# Altium project foxbms2-master.PrjPcb (part 6 of 7)

## Sheet io-matrix.SchDoc
size A3; DocumentNumber: 21; SheetNumber: 21; SheetTotal: 45; SheetDescription: IO Connection Matrix
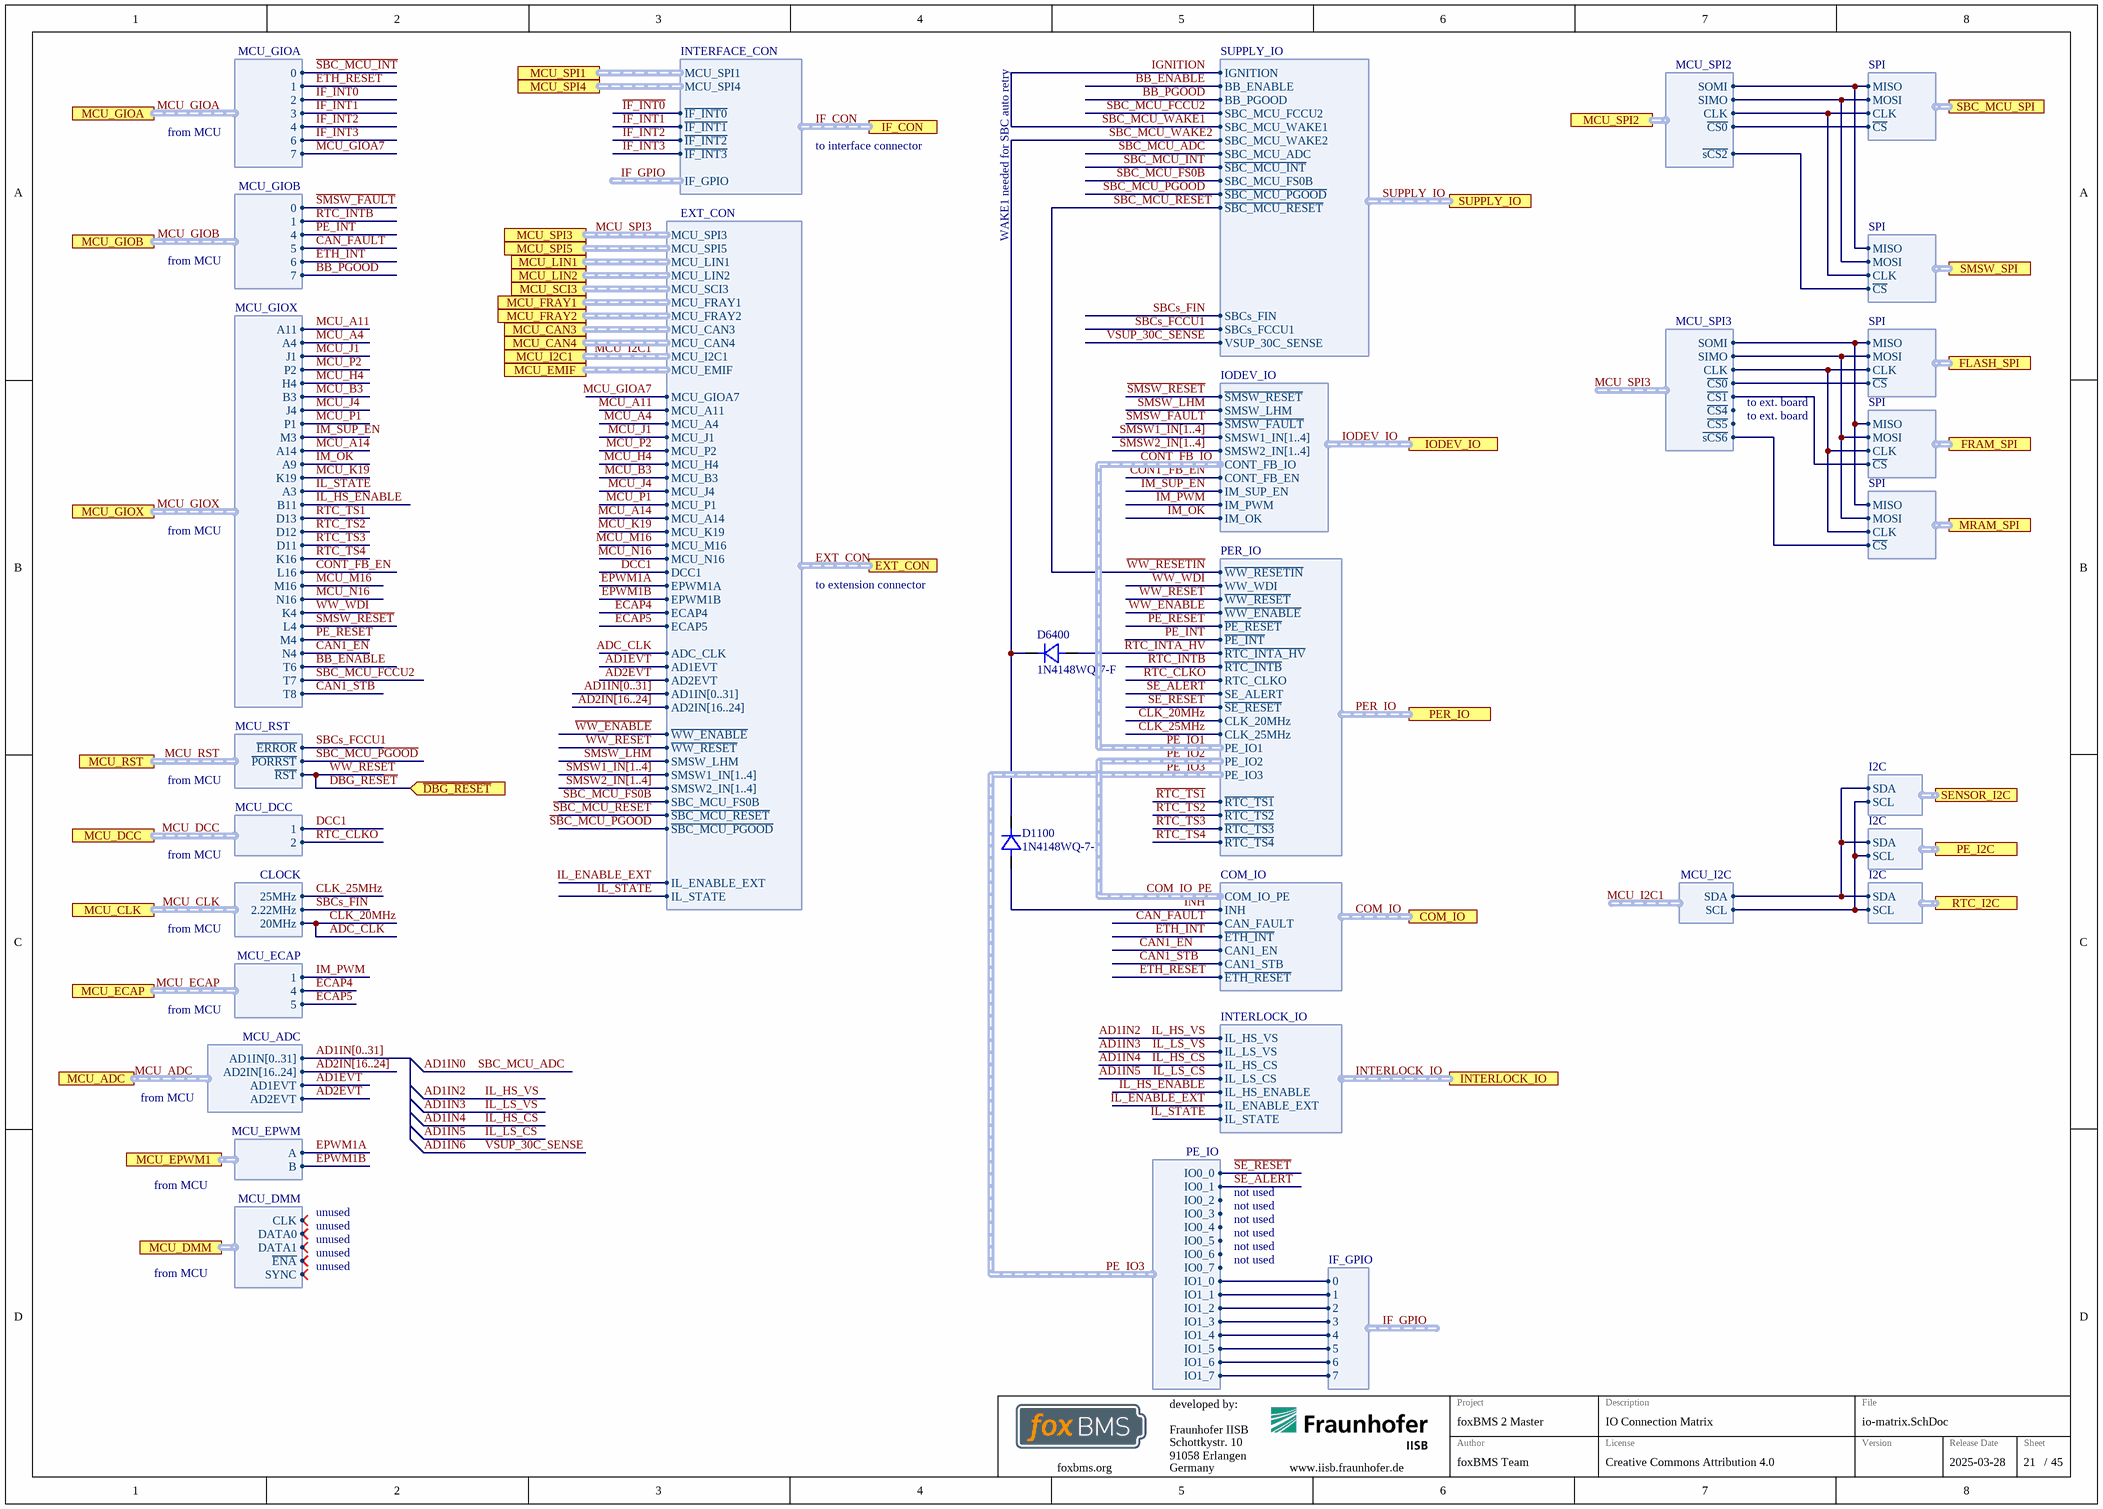
[diagram p20: io-matrix.SchDoc]

### Parts
D1100  1N4148WQ-7-F  [SOD-123_CASE-425-04-ISSUE-G]
D6400  1N4148WQ-7-F  [SOD-123_CASE-425-04-ISSUE-G]

### Ports
COM_IO (harness COM_IO), EXT_CON (harness EXT_CON), FLASH_SPI (harness SPI), FRAM_SPI (harness SPI), IF_CON (harness INTERFACE_CON), INTERLOCK_IO (harness INTERLOCK_IO), IODEV_IO (harness IODEV_IO), MCU_ADC (harness MCU_ADC), MCU_CAN3 (harness MCU_CAN), MCU_CAN4 (harness MCU_CAN), MCU_CLK (harness CLOCK), MCU_DCC (harness MCU_DCC), MCU_DMM (harness MCU_DMM), MCU_ECAP (harness MCU_ECAP), MCU_EMIF (harness MCU_EMIF), MCU_EPWM1 (harness MCU_EPWM), MCU_FRAY1 (harness MCU_FRAY), MCU_FRAY2 (harness MCU_FRAY), MCU_GIOA (harness MCU_GIOA), MCU_GIOB (harness MCU_GIOB), MCU_GIOX (harness MCU_GIOX), MCU_I2C1 (harness MCU_I2C), MCU_LIN1 (harness MCU_LIN), MCU_LIN2 (harness MCU_LIN), MCU_RST (harness MCU_RST), MCU_SCI3 (harness MCU_SCI), MCU_SPI1 (harness MCU_SPI1), MCU_SPI2 (harness MCU_SPI2), MCU_SPI3 (harness MCU_SPI3), MCU_SPI4 (harness MCU_SPI4), MCU_SPI5 (harness MCU_SPI5), MRAM_SPI (harness SPI), PE_I2C (harness I2C), PER_IO (harness PER_IO), RTC_I2C (harness I2C), SBC_MCU_SPI (harness SPI), SENSOR_I2C (harness I2C), SMSW_SPI (harness SPI), SUPPLY_IO (harness SUPPLY_IO), ~{DBG_RESET} (in)

### Harnesses
MCU_GIOX: A11, A4, J1, P2, H4, B3, J4, P1, M3, A14, A9, K19, A3, B11, D13, D12, D11, K16, L16, M16, N16, K4, L4, M4, T6, T7, N4, T8
MCU_SPI2: CLK, SIMO, SOMI, ~{CS0}, ~{sCS2}
MCU_SPI3: CLK, SIMO, SOMI, ~{CS1}, ~{CS4}, ~{CS5}, ~{CS0}, ~{sCS6}
SPI: CLK, MOSI, MISO, ~{CS}
MCU_I2C: SDA, SCL
I2C: SDA, SCL
MCU_GIOA: 0, 2, 3, 4, 6, 7, 1
MCU_RST: ~{ERROR}, ~{PORRST}, ~{RST}
MCU_DCC: 1, 2
MCU_GIOB: 0, 1, 4, 5, 6, 7
CLOCK: 2.22MHz, 20MHz, 25MHz
PE_IO: IO0_0, IO0_1, IO0_2, IO0_3, IO0_4, IO0_5, IO0_6, IO0_7, IO1_0, IO1_1, IO1_2, IO1_3, IO1_4, IO1_5, IO1_6, IO1_7
MCU_ECAP: 1, 4, 5
IODEV_IO: ~{SMSW_RESET}, SMSW_LHM, ~{SMSW_FAULT}, CONT_FB_IO, CONT_FB_EN, IM_SUP_EN, IM_PWM, IM_OK, SMSW1_IN[1..4], SMSW2_IN[1..4]
MCU_ADC: AD2IN[16..24], AD1EVT, AD2EVT, AD1IN[0..31]
SUPPLY_IO: IGNITION, BB_ENABLE, BB_PGOOD, SBC_MCU_FCCU2, SBC_MCU_WAKE1, SBC_MCU_WAKE2, SBC_MCU_ADC, ~{SBC_MCU_INT}, SBC_MCU_FS0B, ~{SBC_MCU_PGOOD}, ~{SBC_MCU_RESET}, SBCs_FIN, SBCs_FCCU1, VSUP_30C_SENSE
COM_IO: COM_IO_PE, CAN_FAULT, ~{ETH_INT}, INH, CAN1_EN, CAN1_STB, ~{ETH_RESET}
PER_IO: WW_WDI, ~{WW_RESET}, ~{WW_ENABLE}, ~{PE_RESET}, ~{PE_INT}, ~{RTC_INTA_HV}, ~{RTC_INTB}, RTC_CLKO, SE_ALERT, ~{SE_RESET}, CLK_20MHz, CLK_25MHz, PE_IO1, PE_IO2, PE_IO3, ~{RTC_TS1}, ~{RTC_TS2}, ~{RTC_TS3}, ~{RTC_TS4}, ~{WW_RESETIN}
INTERLOCK_IO: IL_HS_CS, IL_LS_CS, IL_HS_VS, IL_LS_VS, IL_HS_ENABLE, IL_STATE, IL_ENABLE_EXT
EXT_CON: MCU_SPI3, MCU_SPI5, MCU_LIN1, MCU_LIN2, MCU_FRAY1, MCU_FRAY2, MCU_CAN3, MCU_CAN4, MCU_I2C1, MCU_EMIF, DCC1, EPWM1A, EPWM1B, ECAP4, ECAP5, ADC_CLK, AD1EVT, AD2EVT, AD1IN[0..31], AD2IN[16..24], ~{WW_ENABLE}, ~{WW_RESET}, SMSW_LHM, SMSW1_IN[1..4], SMSW2_IN[1..4], SBC_MCU_FS0B, ~{SBC_MCU_RESET}, ~{SBC_MCU_PGOOD}, IL_ENABLE_EXT, IL_STATE, MCU_GIOA7, MCU_A11, MCU_A4, MCU_J1, MCU_P2, MCU_H4, MCU_B3, MCU_J4, MCU_P1, MCU_A14, MCU_K19, MCU_M16, MCU_N16, MCU_SCI3
IF_GPIO: 0, 1, 2, 3, 4, 5, 6, 7
MCU_EPWM: A, B
MCU_DMM: CLK, DATA0, DATA1, SYNC, ~{ENA}
INTERFACE_CON: MCU_SPI1, MCU_SPI4, ~{IF_INT0}, ~{IF_INT1}, ~{IF_INT2}, ~{IF_INT3}, IF_GPIO

### Nets
~{CAN1_STB}: port MCU_GIOX.T8, port COM_IO.CAN1_STB  [project net CAN1-CTRL~{.}STB]
~{DBG_RESET}: port ~{DBG_RESET}, port MCU_RST.~{RST}, port PER_IO.~{WW_RESET}, port EXT_CON.~{WW_RESET}  [also labelled ~{WW_RESET}]
~{ETH_INT}: port MCU_GIOB.6, port COM_IO.~{ETH_INT}  [project net COM_IO~{.}ETH_INT]
~{ETH_RESET}: port MCU_GIOA.1, port COM_IO.~{ETH_RESET}  [project net COM_IO~{.}ETH_RESET]
~{IF_INT0}: port MCU_GIOA.2, port IF_CON.~{IF_INT0}  [project net IF_CON~{.}IF_INT0]
~{IF_INT1}: port MCU_GIOA.3, port IF_CON.~{IF_INT1}  [project net IF_CON~{.}IF_INT1]
~{IF_INT2}: port MCU_GIOA.4, port IF_CON.~{IF_INT2}  [project net IF_CON~{.}IF_INT2]
~{IF_INT3}: port MCU_GIOA.6, port IF_CON.~{IF_INT3}  [project net IF_CON~{.}IF_INT3]
~{PE_INT}: port MCU_GIOB.4, port PER_IO.~{PE_INT}  [project net MCU_GIOB.4]
~{PE_RESET}: port MCU_GIOX.M4, port PER_IO.~{PE_RESET}  [project net MCU_GIOX.M4]
~{RTC_INTA_HV}: D6400.2(A) ; port PER_IO.~{RTC_INTA_HV}  [project net PER_IO~{.}RTC_INTA_HV]
~{RTC_INTB}: port MCU_GIOB.1, port PER_IO.~{RTC_INTB}  [project net MCU_GIOB.1]
~{RTC_TS1}: port MCU_GIOX.D13, port PER_IO.~{RTC_TS1}  [project net MCU_GIOX.D13]
~{RTC_TS2}: port MCU_GIOX.D12, port PER_IO.~{RTC_TS2}  [project net MCU_GIOX.D12]
~{RTC_TS3}: port MCU_GIOX.D11, port PER_IO.~{RTC_TS3}  [project net MCU_GIOX.D11]
~{RTC_TS4}: port MCU_GIOX.K16, port PER_IO.~{RTC_TS4}  [project net MCU_GIOX.K16]
~{SBC_MCU_INT}: port MCU_GIOA.0, port SUPPLY_IO.~{SBC_MCU_INT}  [project net MCU_GIOA.0]
~{SBC_MCU_PGOOD}: port MCU_RST.~{PORRST}, port SUPPLY_IO.~{SBC_MCU_PGOOD}, port EXT_CON.~{SBC_MCU_PGOOD}  [project net EXT_CON~{.}SBC_MCU_PGOOD]
~{SBC_MCU_RESET}: port SUPPLY_IO.~{SBC_MCU_RESET}, port PER_IO.~{WW_RESETIN}, port EXT_CON.~{SBC_MCU_RESET}  [also labelled ~{WW_RESETIN}]  [project net EXT_CON~{.}SBC_MCU_RESET]
~{SE_RESET}: harness PE_IO.IO0_0, port PER_IO.~{SE_RESET}  [project net PE_IO3.IO0_0]
~{SMSW_FAULT}: port MCU_GIOB.0, port IODEV_IO.~{SMSW_FAULT}  [project net IODEV_IO~{.}SMSW_FAULT]
~{SMSW_RESET}: port MCU_GIOX.L4, port IODEV_IO.~{SMSW_RESET}  [project net IODEV_IO~{.}SMSW_RESET]
~{WW_ENABLE}: port PER_IO.~{WW_ENABLE}, port EXT_CON.~{WW_ENABLE}  [project net EXT_CON~{.}WW_ENABLE]
AD1EVT: port MCU_ADC.AD1EVT, port EXT_CON.AD1EVT  [project net EXT_CON.AD1EVT]
AD2EVT: port MCU_ADC.AD2EVT, port EXT_CON.AD2EVT  [project net EXT_CON.AD2EVT]
ADC_CLK: port MCU_CLK.20MHz, port PER_IO.CLK_20MHz, port EXT_CON.ADC_CLK  [also labelled CLK_20MHz]  [project net EXT_CON.ADC_CLK]
BB_ENABLE: port MCU_GIOX.T6, port SUPPLY_IO.BB_ENABLE  [project net MCU_GIOX.T6]
BB_PGOOD: port MCU_GIOB.7, port SUPPLY_IO.BB_PGOOD  [project net MCU_GIOB.7]
CAN1_EN: port MCU_GIOX.N4, port COM_IO.CAN1_EN  [project net CAN1-CTRL.EN]
CAN_FAULT: port MCU_GIOB.5, port COM_IO.CAN_FAULT  [project net COM_IO.CAN_FAULT]
CLK_25MHz: port MCU_CLK.25MHz, port PER_IO.CLK_25MHz  [project net MCU_CLK.25MHz]
CONT_FB_EN: port MCU_GIOX.L16, port IODEV_IO.CONT_FB_EN  [project net IODEV_IO.CONT_FB_EN]
DCC1: port MCU_DCC.1, port EXT_CON.DCC1  [project net EXT_CON.DCC1]
ECAP4: port MCU_ECAP.4, port EXT_CON.ECAP4  [project net EXT_CON.ECAP4]
ECAP5: port MCU_ECAP.5, port EXT_CON.ECAP5  [project net EXT_CON.ECAP5]
EPWM1A: port EXT_CON.EPWM1A, port MCU_EPWM1.A  [project net EXT_CON.EPWM1A]
EPWM1B: port EXT_CON.EPWM1B, port MCU_EPWM1.B  [project net EXT_CON.EPWM1B]
FLASH_SPI~{.}CS: port MCU_SPI3.~{CS0}, port FLASH_SPI.~{CS}
FLASH_SPI.CLK: port MCU_SPI3.CLK, port FLASH_SPI.CLK, port FRAM_SPI.CLK, port MRAM_SPI.CLK
FLASH_SPI.MISO: port MCU_SPI3.SOMI, port FLASH_SPI.MISO, port FRAM_SPI.MISO, port MRAM_SPI.MISO
FLASH_SPI.MOSI: port MCU_SPI3.SIMO, port FLASH_SPI.MOSI, port FRAM_SPI.MOSI, port MRAM_SPI.MOSI
FRAM_SPI~{.}CS: port MCU_SPI3.~{CS1}, port FRAM_SPI.~{CS}
IF_GPIO.0: harness PE_IO.IO1_0, harness IF_GPIO.0
IF_GPIO.1: harness PE_IO.IO1_1, harness IF_GPIO.1
IF_GPIO.2: harness PE_IO.IO1_2, harness IF_GPIO.2
IF_GPIO.3: harness PE_IO.IO1_3, harness IF_GPIO.3
IF_GPIO.4: harness PE_IO.IO1_4, harness IF_GPIO.4
IF_GPIO.5: harness PE_IO.IO1_5, harness IF_GPIO.5
IF_GPIO.6: harness PE_IO.IO1_6, harness IF_GPIO.6
IF_GPIO.7: harness PE_IO.IO1_7, harness IF_GPIO.7
IGNITION: port SUPPLY_IO.IGNITION, port SUPPLY_IO.SBC_MCU_WAKE1  [also labelled SBC_MCU_WAKE1]  [project net SUPPLY_IO.IGNITION]
IL_ENABLE_EXT: port INTERLOCK_IO.IL_ENABLE_EXT, port EXT_CON.IL_ENABLE_EXT  [project net EXT_CON.IL_ENABLE_EXT]
IL_HS_ENABLE: port MCU_GIOX.B11, port INTERLOCK_IO.IL_HS_ENABLE  [project net INTERLOCK_IO.IL_HS_ENABLE]
IL_STATE: port MCU_GIOX.A3, port INTERLOCK_IO.IL_STATE, port EXT_CON.IL_STATE  [project net EXT_CON.IL_STATE]
IM_OK: port MCU_GIOX.A9, port IODEV_IO.IM_OK  [project net IODEV_IO.IM_OK]
IM_PWM: port MCU_ECAP.1, port IODEV_IO.IM_PWM  [project net IODEV_IO.IM_PWM]
IM_SUP_EN: port MCU_GIOX.M3, port IODEV_IO.IM_SUP_EN  [project net IODEV_IO.IM_SUP_EN]
INH: D1100.2(A) ; port COM_IO.INH  [project net COM_IO.INH]
MCU_A4: port MCU_GIOX.A4, port EXT_CON.MCU_A4  [project net EXT_CON.MCU_A4]
MCU_A11: port MCU_GIOX.A11, port EXT_CON.MCU_A11  [project net EXT_CON.MCU_A11]
MCU_A14: port MCU_GIOX.A14, port EXT_CON.MCU_A14  [project net EXT_CON.MCU_A14]
MCU_B3: port MCU_GIOX.B3, port EXT_CON.MCU_B3  [project net EXT_CON.MCU_B3]
MCU_GIOA7: port MCU_GIOA.7, port EXT_CON.MCU_GIOA7  [project net EXT_CON.MCU_GIOA7]
MCU_H4: port MCU_GIOX.H4, port EXT_CON.MCU_H4  [project net EXT_CON.MCU_H4]
MCU_I2C1.SCL: port MCU_I2C1.SCL, port RTC_I2C.SCL, port PE_I2C.SCL, port SENSOR_I2C.SCL
MCU_I2C1.SDA: port MCU_I2C1.SDA, port RTC_I2C.SDA, port PE_I2C.SDA, port SENSOR_I2C.SDA
MCU_J1: port MCU_GIOX.J1, port EXT_CON.MCU_J1  [project net EXT_CON.MCU_J1]
MCU_J4: port MCU_GIOX.J4, port EXT_CON.MCU_J4  [project net EXT_CON.MCU_J4]
MCU_K19: port MCU_GIOX.K19, port EXT_CON.MCU_K19  [project net EXT_CON.MCU_K19]
MCU_M16: port MCU_GIOX.M16, port EXT_CON.MCU_M16  [project net EXT_CON.MCU_M16]
MCU_N16: port MCU_GIOX.N16, port EXT_CON.MCU_N16  [project net EXT_CON.MCU_N16]
MCU_P1: port MCU_GIOX.P1, port EXT_CON.MCU_P1  [project net EXT_CON.MCU_P1]
MCU_P2: port MCU_GIOX.P2, port EXT_CON.MCU_P2  [project net EXT_CON.MCU_P2]
MCU_SPI2~{.}CS0: port MCU_SPI2.~{CS0}, port SBC_MCU_SPI.~{CS}
MCU_SPI2~{.}sCS2: port MCU_SPI2.~{sCS2}, port SMSW_SPI.~{CS}
MCU_SPI2.CLK: port MCU_SPI2.CLK, port SBC_MCU_SPI.CLK, port SMSW_SPI.CLK
MCU_SPI2.SIMO: port MCU_SPI2.SIMO, port SBC_MCU_SPI.MOSI, port SMSW_SPI.MOSI
MCU_SPI2.SOMI: port MCU_SPI2.SOMI, port SBC_MCU_SPI.MISO, port SMSW_SPI.MISO
MCU_SPI3~{.}sCS6: port MCU_SPI3.~{sCS6}, port MRAM_SPI.~{CS}
RTC_CLKO: port MCU_DCC.2, port PER_IO.RTC_CLKO  [project net MCU_DCC.2]
SBC_MCU_FCCU2: port MCU_GIOX.T7, port SUPPLY_IO.SBC_MCU_FCCU2  [project net MCU_GIOX.T7]
SBC_MCU_FS0B: port SUPPLY_IO.SBC_MCU_FS0B, port EXT_CON.SBC_MCU_FS0B  [project net EXT_CON.SBC_MCU_FS0B]
SBC_MCU_WAKE2: D1100.1(K) D6400.1(K) ; port SUPPLY_IO.SBC_MCU_WAKE2  [project net SUPPLY_IO.SBC_MCU_WAKE2]
SBCs_FCCU1: port MCU_RST.~{ERROR}, port SUPPLY_IO.SBCs_FCCU1  [project net MCU_RST~{.}ERROR]
SBCs_FIN: port MCU_CLK.2.22MHz, port SUPPLY_IO.SBCs_FIN  [project net MCU_CLK.2.22MHz]
SE_ALERT: harness PE_IO.IO0_1, port PER_IO.SE_ALERT  [project net PE_IO3.IO0_1]
SMSW_LHM: port IODEV_IO.SMSW_LHM, port EXT_CON.SMSW_LHM  [project net EXT_CON.SMSW_LHM]
WW_WDI: port MCU_GIOX.K4, port PER_IO.WW_WDI  [project net MCU_GIOX.K4]

### Buses and harness runs
bus AD1IN[0..31]
bus AD2IN[16..24]
bus SMSW1_IN[1..4]
bus SMSW2_IN[1..4]
harness COM_IO = port COM_IO
harness COM_IO_PE = PE_IO2
harness CONT_FB_IO = PE_IO1
harness EXT_CON = port EXT_CON
harness IF_CON = port IF_CON
harness INTERLOCK_IO = port INTERLOCK_IO
harness IODEV_IO = port IODEV_IO
harness MCU_ADC = port MCU_ADC
harness MCU_CLK = port MCU_CLK
harness MCU_DCC = port MCU_DCC
harness MCU_ECAP = port MCU_ECAP
harness MCU_GIOA = port MCU_GIOA
harness MCU_GIOB = port MCU_GIOB
harness MCU_GIOX = port MCU_GIOX
harness MCU_I2C1 = port MCU_I2C1
harness MCU_RST = port MCU_RST
harness MCU_SPI3 = port MCU_SPI3
harness PER_IO = port PER_IO
harness SUPPLY_IO = port SUPPLY_IO

### Notes on the sheet
- from MCU
- to interface connector
- WAKE1 needed for SBC auto retry
- to ext. board
- to extension connector
- unused
- not used
- Fraunhofer IISB
- Schottkystr. 10
- developed by:
- 91058 Erlangen
- Germany
- Author
- Project
- License
- Description
- File
- Version
- Release Date
- Sheet
- foxbms.org <https://foxbms.org>
- www.iisb.fraunhofer.de <https://www.iisb.fraunhofer.de/>
- foxBMS Team
- /

### Library data of the parts
D1100 D6400 = 1N4148WQ-7-F: as D7004 on sheet supply; Part Number: 1N4148WQ-7-F; Part Name: 1N4148WQ-7-F; Operating Temperature: -65°C - +150°C; ComponentLink1Description: Datasheet; ComponentLink1URL: https://www.diodes.com/assets/Datasheets/ds30086.pdf; Supplier 1: Digikey; Supplier Part Number 1: 1N4148WQ-7-FDICT-ND; Supplier 2: Farnell; Supplier Part Number 2: 3127171; Supplier 3: Mouser; Supplier Part Number 3: 621-1N4148WQ-7-F

## Sheet interlock.SchDoc
size A3; DocumentNumber: 14; SheetNumber: 14; SheetTotal: 45; SheetDescription: Interlock Circuit
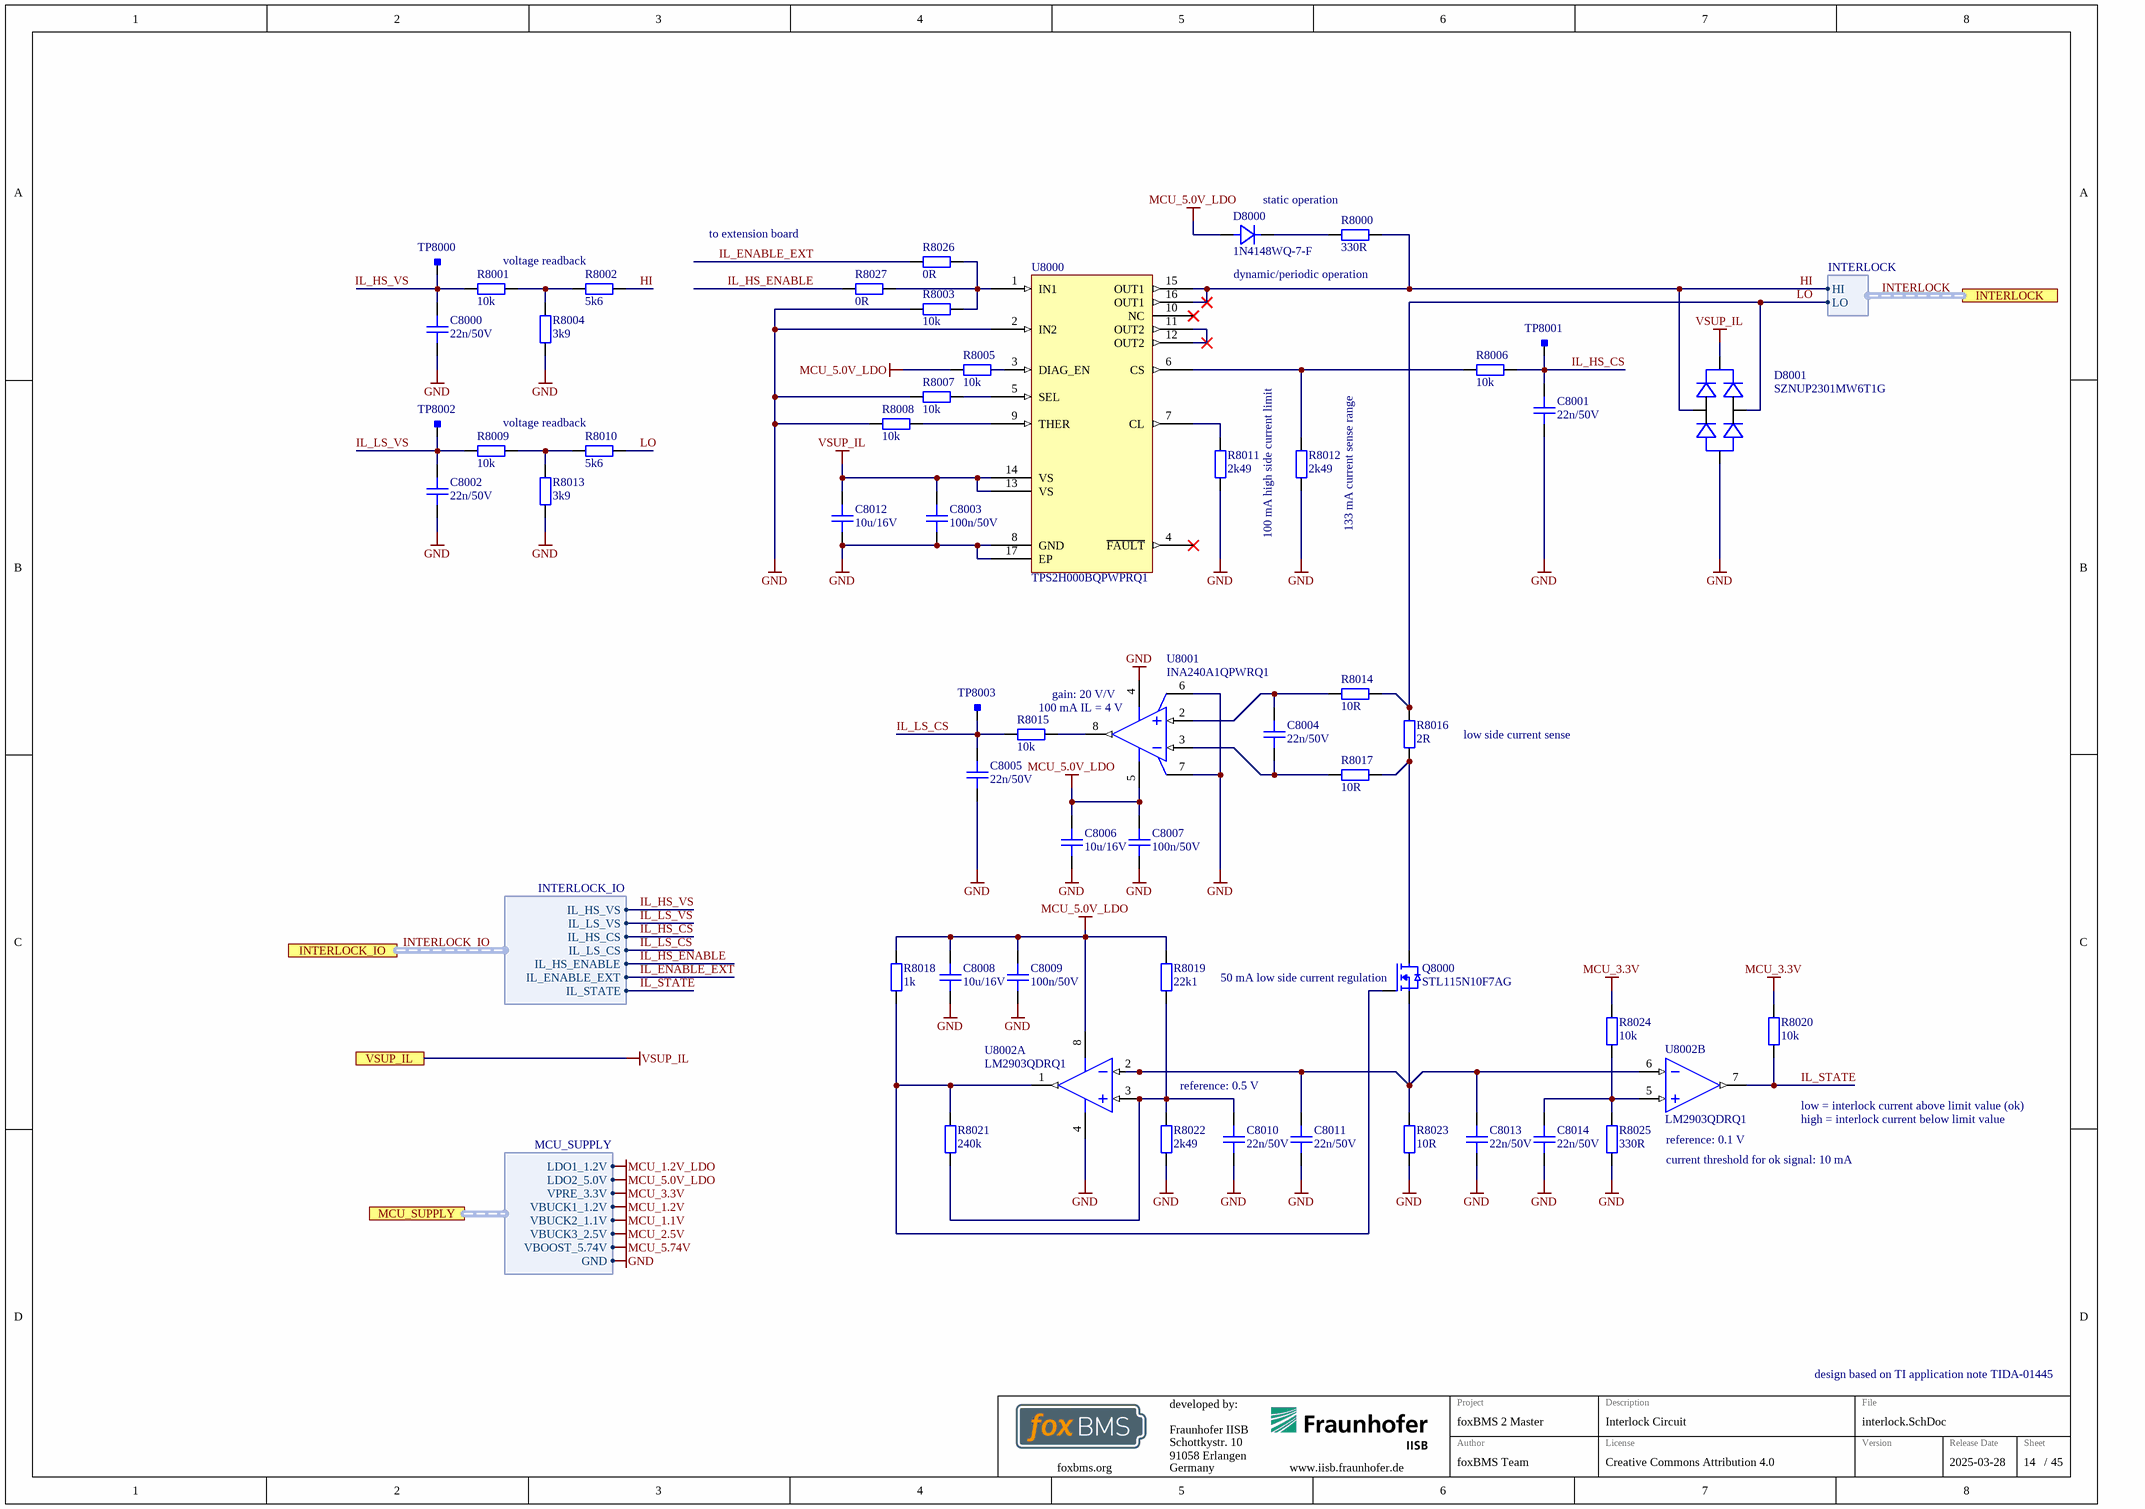
[diagram p21: interlock.SchDoc]

### Parts
C8000  22n/50V  [CAPC1005X06N]
C8001  22n/50V  [CAPC1005X06N]
C8002  22n/50V  [CAPC1005X06N]
C8003  100n/50V  [CAPC1005X06N]
C8004  22n/50V  [CAPC1005X06N]
C8005  22n/50V  [CAPC1005X06N]
C8006  10u/16V  [CAPC2012X14N]
C8007  100n/50V  [CAPC1005X06N]
C8008  10u/16V  [CAPC2012X14N]
C8009  100n/50V  [CAPC1005X06N]
C8010  22n/50V  [CAPC1005X06N]
C8011  22n/50V  [CAPC1005X06N]
C8012  10u/16V  [CAPC2012X14N]
C8013  22n/50V  [CAPC1005X06N]
C8014  22n/50V  [CAPC1005X06N]
D8000  1N4148WQ-7-F  [SOD-123_CASE-425-04-ISSUE-G]
D8001  SZNUP2301MW6T1G  [ONSEMI_SC-88_SOT-363]
Q8000  STL115N10F7AG  [ST_PowerFLAT_5x6_WF_type_C]
R8000  330R  [RESC1608X05N]
R8001  10k  [RESC1005X04N]
R8002  5k6  [RESC1005X04N]
R8003  10k  [RESC1005X04N]
R8004  3k9  [RESC1005X04N]
R8005  10k  [RESC1005X04N]
R8006  10k  [RESC1005X04N]
R8007  10k  [RESC1005X04N]
R8008  10k  [RESC1005X04N]
R8009  10k  [RESC1005X04N]
R8010  5k6  [RESC1005X04N]
R8011  2k49  [RESC1005X04N]
R8012  2k49  [RESC1005X04N]
R8013  3k9  [RESC1005X04N]
R8014  10R  [RESC1005X04N]
R8015  10k  [RESC1005X04N]
R8016  2R  [RESC2012X05N]
R8017  10R  [RESC1005X04N]
R8018  1k  [RESC1005X04N]
R8019  22k1  [RESC1005X04N]
R8020  10k  [RESC1005X04N]
R8021  240k  [RESC1005X04N]
R8022  2k49  [RESC1005X04N]
R8023  10R  [RESC2012X05N]
R8024  10k  [RESC1005X04N]
R8025  330R  [RESC1005X04N]
R8026  0R  [RESC1005X04N]
R8027  0R  [RESC1005X04N]
TP8000  Testpoint_Square  [Testpoint_S1]  (value not drawn)  (no BOM)
TP8001  Testpoint_Square  [Testpoint_S1]  (value not drawn)  (no BOM)
TP8002  Testpoint_Square  [Testpoint_S1]  (value not drawn)  (no BOM)
TP8003  Testpoint_Square  [Testpoint_S1]  (value not drawn)  (no BOM)
U8000  TPS2H000BQPWPRQ1  [TI_PWP0016J]
U8001  INA240A1QPWRQ1  [TI_PW0008A]
U8002  LM2903QDRQ1  [TI_D0008A]  (parts A,B of 2)

### Ports
INTERLOCK (harness INTERLOCK), INTERLOCK_IO (harness INTERLOCK_IO), MCU_SUPPLY (harness MCU_SUPPLY), VSUP_IL

### Harnesses
INTERLOCK: HI, LO
INTERLOCK_IO: IL_HS_CS, IL_LS_CS, IL_HS_VS, IL_LS_VS, IL_HS_ENABLE, IL_STATE, IL_ENABLE_EXT
MCU_SUPPLY: VBUCK1_1.2V, VBUCK2_1.1V, VBUCK3_2.5V, LDO1_1.2V, LDO2_5.0V, GND, VPRE_3.3V, VBOOST_5.74V

### Nets
GND: C8000.1 C8001.1 C8002.1 C8003.1 C8005.1 C8006.1 C8007.1 C8008.1 C8009.1 C8010.1 C8011.2 C8012.1 C8013.2 C8014.1 D8001.1(Anode) R8003.2 R8004.1 R8007.2 R8008.2 R8011.2 R8012.2 R8013.1 R8022.1 R8023.2 R8025.1 U8000.2(IN2) U8000.8(GND) U8000.17(EP) U8001.4(-VS) U8001.6(REF2) U8001.7(REF1) U8002.4(GND) ; port MCU_SUPPLY.GND
MCU_3.3V: R8020.1 R8024.1 ; port MCU_SUPPLY.VPRE_3.3V
MCU_5.0V_LDO: C8006.2 C8007.2 C8008.2 C8009.2 D8000.2(A) R8005.2 R8018.2 R8019.1 U8001.5(+VS) U8002.8(VCC) ; port MCU_SUPPLY.LDO2_5.0V
VSUP_IL: C8003.2 C8012.2 D8001.3(Cathode) U8000.13(VS) U8000.14(VS) ; port VSUP_IL  [project net VBB_12V]
HI: D8001.2(Common) R8000.1 R8002.2 U8000.15(OUT1) U8000.16(OUT1) ; port INTERLOCK.HI  [project net INTERLOCK.HI]
IL_ENABLE_EXT: R8026.1 ; port INTERLOCK_IO.IL_ENABLE_EXT  [project net EXT_CON.IL_ENABLE_EXT]
IL_HS_CS: C8001.2 R8006.1 TP8001.1 ; port INTERLOCK_IO.IL_HS_CS  [project net INTERLOCK_IO.IL_HS_CS]
IL_HS_ENABLE: R8027.1 ; port INTERLOCK_IO.IL_HS_ENABLE  [project net INTERLOCK_IO.IL_HS_ENABLE]
IL_HS_VS: C8000.2 R8001.1 TP8000.1 ; port INTERLOCK_IO.IL_HS_VS  [project net INTERLOCK_IO.IL_HS_VS]
IL_LS_CS: C8005.2 R8015.1 TP8003.1 ; port INTERLOCK_IO.IL_LS_CS  [project net INTERLOCK_IO.IL_LS_CS]
IL_LS_VS: C8002.2 R8009.1 TP8002.1 ; port INTERLOCK_IO.IL_LS_VS  [project net INTERLOCK_IO.IL_LS_VS]
IL_STATE: R8020.2 U8002.7(2OUT) ; port INTERLOCK_IO.IL_STATE  [project net EXT_CON.IL_STATE]
LO: D8001.5(Common) R8010.2 R8014.2 R8016.1 ; port INTERLOCK.LO  [project net INTERLOCK.LO]
NetC8004_1: C8004.1 R8017.1 U8001.3(-IN)
NetC8004_2: C8004.2 R8014.1 U8001.2(+IN)
NetC8010_2: C8010.2 R8019.2 R8021.1 R8022.2 U8002.3(1IN+)
NetC8011_1: C8011.1 C8013.1 Q8000.S R8023.1 U8002.2(1IN-) U8002.6(2IN-)
NetC8014_2: C8014.2 R8024.2 R8025.2 U8002.5(2IN+)
NetD8000_1: D8000.1(K) R8000.2
NetQ8000_D: Q8000.D R8016.2 R8017.2
NetQ8000_G: Q8000.G R8018.1 R8021.2 U8002.1(1OUT)
NetR8001_2: R8001.2 R8002.1 R8004.2
NetR8003_1: R8003.1 R8026.2 R8027.2 U8000.1(IN1)
NetR8005_1: R8005.1 U8000.3(DIAG_EN)
NetR8006_2: R8006.2 R8012.1 U8000.6(CS)
NetR8007_1: R8007.1 U8000.5(SEL)
NetR8008_1: R8008.1 U8000.9(THER)
NetR8009_2: R8009.2 R8010.1 R8013.2
NetR8011_1: R8011.1 U8000.7(CL)
NetR8015_2: R8015.2 U8001.8(VOUT)
NetU8000_11: U8000.11(OUT2) U8000.12(OUT2)

Not connected (* = marked no-connect by the designer): U8000 4(~{FAULT})* 10(NC)*

### Buses and harness runs
harness INTERLOCK = port INTERLOCK
harness INTERLOCK_IO = port INTERLOCK_IO

### Notes on the sheet
- to extension board
- static operation
- voltage readback
- dynamic/periodic operation
- 100 mA high side current limit
- (near R8012) 133 mA current sense range
- (near U8001) 100 mA IL = 4 V
- (near U8001) gain: 20 V/V
- low side current sense
- (near Q8000) 50 mA low side current regulation
- reference: 0.5 V
- low = interlock current above limit value (ok)
- high = interlock current below limit value
- reference: 0.1 V
- current threshold for ok signal: 10 mA
- design based on TI application note TIDA-01445
- Fraunhofer IISB
- Schottkystr. 10
- developed by:
- 91058 Erlangen
- Germany
- Author
- Project
- License
- Description
- File
- Version
- Release Date
- Sheet
- foxbms.org <https://foxbms.org>
- www.iisb.fraunhofer.de <https://www.iisb.fraunhofer.de/>
- foxBMS Team
- /

### Library data of the parts
C8000-C8002 C8004 C8005 C8010 C8011 C8013 C8014 = gen_C_ceramic_22n_50V_X7R_0402: MLCC; Capacitance: 22n; Rated Voltage: 50V; Dielectric: X7R; Case EIA: 0402; Case Metric: 1005; Automotive Qualified: True; AEC-Q Norm: AEC-Q200; AEC-Q Grade: Grade 1; PnP Package: 0402C; Part Number: gen_C_ceramic_22n_50V_X7R_0402; Supplier 1: Digikey; Supplier Part Number 1: 490-4763-1-ND; ECCN: EAR99
C8003 C8007 C8009 = gen_C_ceramic_100n_50V_X7R_0402: as C7213 on sheet sbc-base; Part Number: gen_C_ceramic_100n_50V_X7R_0402; Supplier 1: Farnell; Supplier Part Number 1: 2210822; ECCN: EAR99
C8006 C8008 C8012 = gen_C_ceramic_10u_16V_X7R_0805: as C7216 on sheet sbc-base; Part Number: gen_C_ceramic_10u_16V_X7R_0805; ECCN: EAR99; Supplier 1: Digikey; Supplier Part Number 1: 445-16110-1-ND
D8000 = 1N4148WQ-7-F: as D7004 on sheet supply; Part Number: 1N4148WQ-7-F; Part Name: 1N4148WQ-7-F; Operating Temperature: -65°C - +150°C; ComponentLink1Description: Datasheet; ComponentLink1URL: https://www.diodes.com/assets/Datasheets/ds30086.pdf; Supplier 1: Digikey; Supplier Part Number 1: 1N4148WQ-7-FDICT-ND
D8001 = SZNUP2301MW6T1G: TVS diode array; Manufacturer: ON Semiconductor; Breakdown Voltage: 70V; Automotive Qualified: True; AEC-Q Norm: AEC-Q101; AEC-Q Grade: Grade 0; Part Number: SZNUP2301MW6T1G; Part Name: SZNUP2301MW6T1G; Operating Temperature: -55°C - +150°C; ComponentLink1Description: Datasheet; ComponentLink1URL: https://www.mouser.de/datasheet/2/308/1/NUP2301MW6T1_D-2319422.pdf; Supplier 1: Mouser; Supplier Part Number 1: 863-SZNUP2301MW6T1G; ECCN: EAR99
Q8000 = STL115N10F7AG: N-Channel MOSFET, 100 V, 107 A, 5 mOhm; Manufacturer: STMicroelectronics; Maximum Drain-Source Voltage: 100V; Maximum Continous Drain Current (25°C): 107A; R_DS(on): 5m; Total Gate Charge: 72.5nC; Automotive Qualified: True; AEC-Q Norm: AEC-Q101; AEC-Q Grade: Grade 0; Part Number: STL115N10F7AG; Part Name: NMOS; Operating Temperature: -55°C - +175°C; ComponentLink1Description: Datasheet; ComponentLink1URL: https://www.mouser.de/datasheet/2/389/dm00333356-1798814.pdf; Supplier 1: Mouser; Supplier Part Number 1: 511-STL115N10F7AG; Supplier 2: Digikey; Supplier Part Number 2: 497-17622-1-ND; ECCN: EAR99
R8000 = gen_R_330R_0603: SMD Resistor 330R 0603; Power: 0.1W; Case EIA: 0603; Case Metric: 1608; Maximum Working Voltage: 75V; PnP Package: 0603R; Automotive Qualified: True; Tolerance: 1%; Part Number: gen_R_330R_0603; Operating Temperature: -55°C - +155°C; Resistance: 330R; Series: E24; PnP Value: 330R; Supplier 1: Farnell; Supplier Part Number 1: 2692155
R8001 R8003 R8005-R8009 R8015 R8020 R8024 = gen_R_10k_0402: SMD Resistor 10k 0402; Power: 0.063W; Case EIA: 0402; Case Metric: 1005; Maximum Working Voltage: 50V; PnP Package: 0402R; Automotive Qualified: True; Tolerance: 1%; PnP equipped: x; AEC-Q Norm: AEC-Q200; Part Number: gen_R_10k_0402; Operating Temperature: -55°C - +155°C; Resistance: 10k; Series: E24, E96; PnP Value: 10k; Supplier 1: Farnell; Supplier Part Number 1: 2059239; ECCN: EAR99
R8002 R8010 = gen_R_5k6_0402: SMD Resistor 5k6 0402; Power: 0.063W; Case EIA: 0402; Case Metric: 1005; Maximum Working Voltage: 50V; PnP Package: 0402R; Automotive Qualified: True; Tolerance: 1%; AEC-Q Norm: AEC-Q200; AEC-Q Grade: Grade 0; Part Number: gen_R_5k6_0402; Operating Temperature: -55°C - +155°C; Resistance: 5k6; Series: E24; PnP Value: 5k6; Supplier 1: Digikey; Supplier Part Number 1: A129636CT-ND; ECCN: EAR99
R8004 R8013 = gen_R_3k9_0402: SMD Resistor 3k9 0402; Power: 0.063W; Case EIA: 0402; Case Metric: 1005; Maximum Working Voltage: 50V; PnP Package: 0402R; Automotive Qualified: True; Tolerance: 1%; AEC-Q Grade: Grade 0; AEC-Q Norm: AEC-Q200; Part Number: gen_R_3k9_0402; Operating Temperature: -55°C - +155°C; Resistance: 3k9; Series: E24; PnP Value: 3k9; ECCN: EAR99; Supplier 1: Farnell; Supplier Part Number 1: 2302698
R8011 R8012 R8022 = gen_R_2k49_0402: SMD Resistor 2k49 0402; Power: 0.063W; Case EIA: 0402; Case Metric: 1005; Maximum Working Voltage: 50V; PnP Package: 0402R; Automotive Qualified: True; Tolerance: 1%; Part Number: gen_R_2k49_0402; Operating Temperature: -55°C - +155°C; Resistance: 2k49; Series: E96; PnP Value: 2k49; Supplier 1: Farnell; Supplier Part Number 1: 2059135
R8014 R8017 = gen_R_10R_0402: SMD Resistor 10R 0402; Power: 0.063W; Case EIA: 0402; Case Metric: 1005; Maximum Working Voltage: 50V; PnP Package: 0402R; Automotive Qualified: True; Tolerance: 1%; Part Number: gen_R_10R_0402; Operating Temperature: -55°C - +155°C; Resistance: 10R; Series: E24, E96; PnP Value: 10R; Supplier 1: Farnell; Supplier Part Number 1: 2302417
R8016 = gen_R_2R_0805: SMD Resistor 2R 0805; Power: 0.125W; Case EIA: 0805; Case Metric: 2012; Maximum Working Voltage: 150V; PnP Package: 0805R; Automotive Qualified: True; Tolerance: 1%; AEC-Q Grade: Grade 0; AEC-Q Norm: AEC-Q200; Part Number: gen_R_2R_0805; Operating Temperature: -55°C - +155°C; Resistance: 2R; Series: E24, E96; PnP Value: 2R; ECCN: EAR99; Supplier 1: Digikey; Supplier Part Number 1: P19275CT-ND
R8018 = gen_R_1k_0402: SMD Resistor 1k 0402; Power: 0.063W; Case EIA: 0402; Case Metric: 1005; Maximum Working Voltage: 50V; PnP Package: 0402R; Automotive Qualified: True; Tolerance: 1%; PnP equipped: x; AEC-Q Norm: AEC-Q200; Part Number: gen_R_1k_0402; Operating Temperature: -55°C - +155°C; Resistance: 1k; Series: E24, E96; PnP Value: 1k; Supplier 1: Farnell; Supplier Part Number 1: 2302638; ECCN: EAR99
R8019 = gen_R_22k1_0402: SMD Resistor 22k1 0402; Power: 0.063W; Case EIA: 0402; Case Metric: 1005; Maximum Working Voltage: 50V; PnP Package: 0402R; Automotive Qualified: True; Tolerance: 1%; AEC-Q Norm: AEC-Q200; AEC-Q Grade: Grade 0; Part Number: gen_R_22k1_0402; Operating Temperature: -55°C - +155°C; Resistance: 22k1; Series: E96; PnP Value: 22k1; ECCN: EAR99; Supplier 1: Farnell; Supplier Part Number 1: 2563485
R8021 = gen_R_240k_0402: SMD Resistor 240k 0402; Power: 0.063W; Case EIA: 0402; Case Metric: 1005; Maximum Working Voltage: 50V; PnP Package: 0402R; Automotive Qualified: True; Tolerance: 1%; AEC-Q Norm: AEC-Q200; AEC-Q Grade: Grade 0; Part Number: gen_R_240k_0402; Operating Temperature: -55°C - +155°C; Resistance: 240k; Series: E24; PnP Value: 240k; Supplier 1: Digikey; Supplier Part Number 1: P240KLCT-ND; ECCN: EAR99
R8023 = gen_R_10R_0805: SMD Resistor 10R 0805; Power: 0.125W; Case EIA: 0805; Case Metric: 2012; Maximum Working Voltage: 150V; PnP Package: 0805R; Automotive Qualified: True; Tolerance: 1%; AEC-Q Grade: Grade 0; AEC-Q Norm: AEC-Q200; Part Number: gen_R_10R_0805; Operating Temperature: -55°C - +155°C; Resistance: 10R; Series: E24, E96; PnP Value: 10R; ECCN: EAR99; Supplier 1: Farnell; Supplier Part Number 1: 1750728
R8025 = gen_R_330R_0402: SMD Resistor 330R 0402; Power: 0.063W; Case EIA: 0402; Case Metric: 1005; Maximum Working Voltage: 50V; PnP Package: 0402R; Automotive Qualified: True; Tolerance: 1%; AEC-Q Grade: Grade 0; AEC-Q Norm: AEC-Q200; Part Number: gen_R_330R_0402; Operating Temperature: -55°C - +155°C; Resistance: 330R; Series: E24; PnP Value: 330R; ECCN: EAR99; Supplier 1: Farnell; Supplier Part Number 1: 2302581
R8026 R8027 = gen_R_0R_0402: as R7219 on sheet sbc-base; Part Number: gen_R_0R_0402; Operating Temperature: -55°C - +155°C; Resistance: 0R; Series: Jumper; PnP Value: 0R; Supplier 1: Farnell; Supplier Part Number 1: 1469661; Supplier 2: Farnell; Supplier Part Number 2: 2059190; ECCN: EAR99
TP8000-TP8003 = Testpoint_Square: as TP_GND on sheet supply; Part Number: Testpoint_Square
U8000 = TPS2H000BQPWPRQ1: 1000-mΩ Dual-Channel SmartHigh-Side Power Switch; Manufacturer: Texas Instruments; Automotive Qualified: True; AEC-Q Norm: AEC-Q100; AEC-Q Grade: Grade 1; Part Number: TPS2H000BQPWPRQ1; Part Name: TPS2H000BQPWPRQ1; Operating Temperature: −40°C - +125°C; ComponentLink1Description: Datasheet; ComponentLink1URL: http://www.ti.com/lit/ds/symlink/tps2h000-q1.pdf; Supplier 1: Mouser; Supplier Part Number 1: 595-TPS2H000BQPWPRQ1; Supplier 2: Digikey; Supplier Part Number 2: 296-45179-1-ND; Supplier 3: Farnell; Supplier Part Number 3: 3124090; ECCN: EAR99
U8001 = INA240A1QPWRQ1: Automotive, Wide Common-Mode Range, High- and Low-Side, Bidirectional, Zero-Drift, Current-Sense Amplifier With Enhanced PWM Rejection; Manufacturer: Texas Instruments; Amplifier Type: Instrumentation; Number of Circuits: 1; Slew Rate: 35V/µs; Mfg Application Notes: WaterAnalysisSolutionforpH&ConductivityMeters; Current - Supply: 2mA; Voltage - Supply, Single/Dual (±): 5V~36V,±2.5V~18V; Current - Input Bias: 1nA; Product Training Modules: CommonPhotodiodeOp-AmpCircuitProblemsandSolutionsIndirectCurrentFeedbackInstrumentationAmplifierApplicationsGuide; Voltage - Input Offset: 60µV; Featured Product: AD8421InstrumentationAmplifier; EDA / CAD Models: DownloadfromAcceleratedDesigns; -3db Bandwidth: 10MHz; Package Version: 10/2009; Current - Output / Channel: 65mA; Automotive Qualified: True; AEC-Q Norm: AEC-Q100; AEC-Q Grade: Grade 1; Series: -; Category: IntegratedCircuits(ICs); Output Type: -; Package Reference: RM-8; Datasheet Version: Rev. 0, 05/2012; Family: Linear-Amplifiers-Instrumentation,OPAmps,BufferAmps; Packaging: Tube; Standard Package: 50; Online Catalog: Instrumentation; Operating Temperature: −40°C - +125°C; Package Description: 8-Pin Mini Small Outline Package, Body 3 x 3 mm, Pitch 0.65 mm; Package / Case: 8-TSSOP,8-MSOP(0.118",3.00mmWidth); Mounting Technology: SurfaceMount; Manufacturer URL: http://www.analog.com/; Mounting Type: SurfaceMount; Datasheet URL: http://www.analog.com/media/en/technical-documentation/data-sheets/AD8421.pdf; Gain Bandwidth Product: -; Supplier Device Package: 8-MSOP; Package URL: http://www.analog.com/static/imported-files/packages/PKG_PDF/MSOP%28RM%29/RM_8.pdf; Part Number: INA240A1QPWRQ1; Part Name: INA240A1QPWRQ1; ComponentLink1Description: Datasheet; ComponentLink1URL: http://www.ti.com/lit/ds/symlink/ina240-q1.pdf; Supplier 1: Mouser; Supplier Part Number 1: 595-INA240A1QPWRQ1; Supplier 2: Digikey; Supplier Part Number 2: 296-50472-1-ND; ECCN: EAR99
U8002 = LM2903QDRQ1: Automotive Dual Comparators; Manufacturer: Texas Instruments; Automotive Qualified: True; AEC-Q Norm: AEC-Q100; AEC-Q Grade: Grade 1; Part Number: LM2903QDRQ1; Part Name: LM2903QDRQ1; Operating Temperature: −40°C - +125°C; ComponentLink1Description: Datasheet; ComponentLink1URL: http://www.ti.com/lit/ds/symlink/lm2903-q1.pdf; Supplier 1: Mouser; Supplier Part Number 1: 595-LM2903QDRQ1; Supplier 2: Digikey; Supplier Part Number 2: 296-15183-1-ND; ECCN: EAR99